# Altium schematic sheet RadToF.SchDoc
size B; SheetNumber: 1; SheetTotal: 4
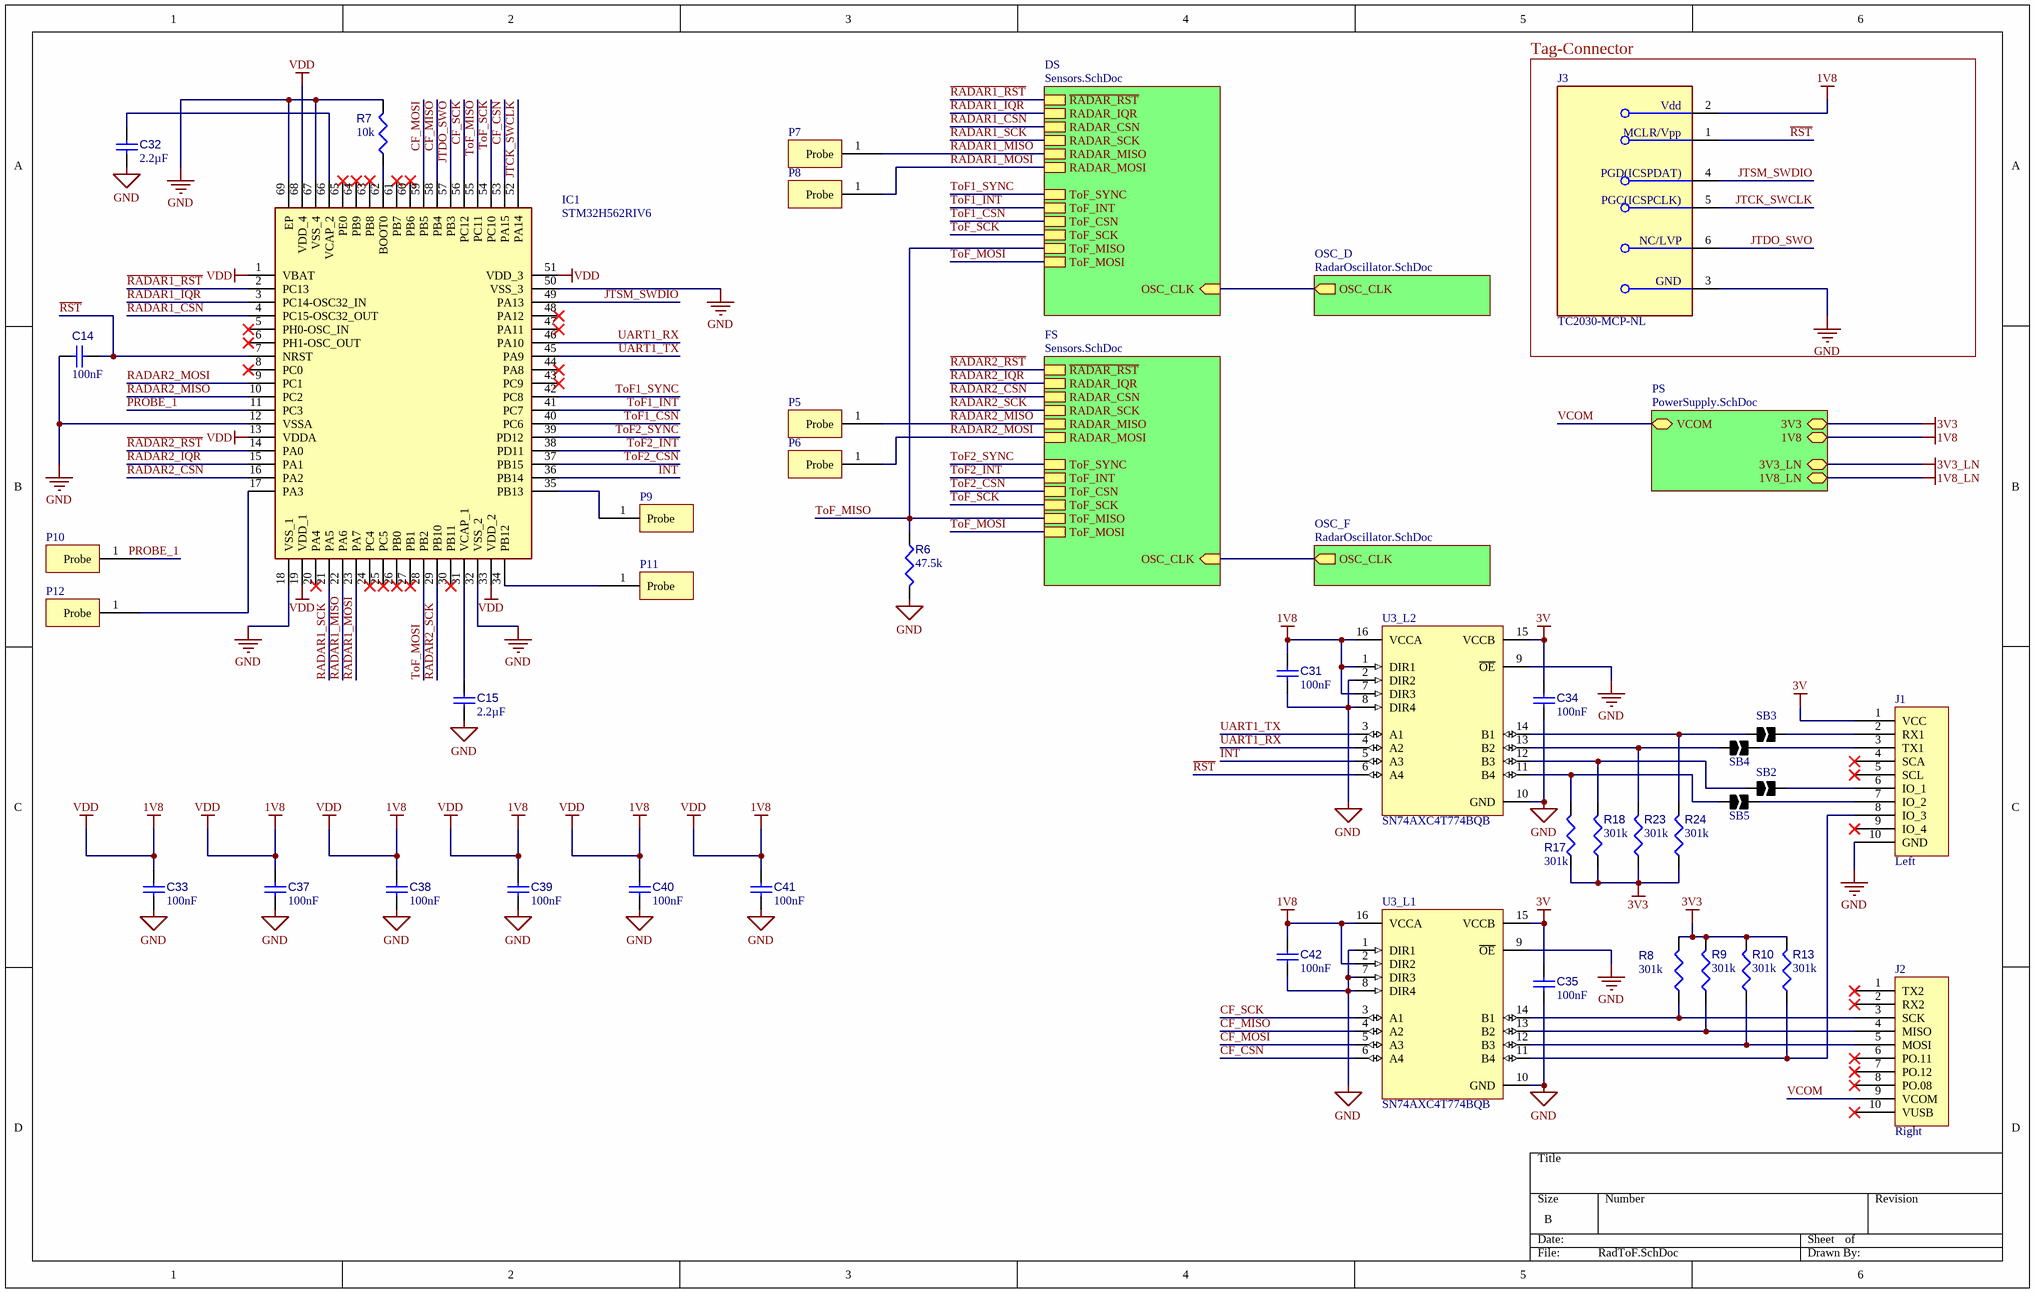
[diagram p0: RadToF.SchDoc]

## Parts
C14  value 100nF  [CAPC0402(1005)60_L]  (hidden comment: Capacitor 100nF +/-20% 50V 0402)
C15  value 2.2µF  [CAPC0402(1005)60_L]  (hidden comment: Capacitor 2,2µF +/-20% 10V 0402)
C31  value 100nF  [CAPC0402(1005)60_L]  (hidden comment: Capacitor 100nF +/-20% 50V 0402)
C32  value 2.2µF  [CAPC0402(1005)60_L]  (hidden comment: Capacitor 2,2µF +/-20% 10V 0402)
C33  value 100nF  [CAPC0402(1005)60_L]  (hidden comment: Capacitor 100nF +/-20% 50V 0402)
C34  value 100nF  [CAPC0402(1005)60_L]  (hidden comment: Capacitor 100nF +/-20% 50V 0402)
C35  value 100nF  [CAPC0402(1005)60_L]  (hidden comment: Capacitor 100nF +/-20% 50V 0402)
C37  value 100nF  [CAPC0402(1005)60_L]  (hidden comment: Capacitor 100nF +/-20% 50V 0402)
C38  value 100nF  [CAPC0402(1005)60_L]  (hidden comment: Capacitor 100nF +/-20% 50V 0402)
C39  value 100nF  [CAPC0402(1005)60_L]  (hidden comment: Capacitor 100nF +/-20% 50V 0402)
C40  value 100nF  [CAPC0402(1005)60_L]  (hidden comment: Capacitor 100nF +/-20% 50V 0402)
C41  value 100nF  [CAPC0402(1005)60_L]  (hidden comment: Capacitor 100nF +/-20% 50V 0402)
C42  value 100nF  [CAPC0402(1005)60_L]  (hidden comment: Capacitor 100nF +/-20% 50V 0402)
IC1  STM32H562RIV6  [STM32H562RIV6]
J1  Left  [CrazyFlieConnector]
J2  Right  [CrazyFlieConnector]
J3  TC2030-MCP-NL  [FP-TC2030-MCP-NL-MFG]
P5  (no value)  [test pad]
P6  (no value)  [test pad]
P7  (no value)  [test pad]
P8  (no value)  [test pad]
P9  (no value)  [test pad]
P10  (no value)  [test pad]
P11  (no value)  [test pad]
P12  (no value)  [test pad]
R6  value 47.5k  [RESC0402(1005)_L]  (hidden comment: Resistor 47K5 +/-1 % 0402 63 mW)
R7  value 10k  [RESC0402(1005)_L]  (hidden comment: Resistor 10K  +/-1 % 0402 63 mW)
R8  value 301k  [RESC0402(1005)_L]  (hidden comment: 301KR2F)
R9  value 301k  [RESC0402(1005)_L]  (hidden comment: 301KR2F)
R10  value 301k  [RESC0402(1005)_L]  (hidden comment: 301KR2F)
R13  value 301k  [RESC0402(1005)_L]  (hidden comment: 301KR2F)
R17  value 301k  [RESC0402(1005)_L]  (hidden comment: 301KR2F)
R18  value 301k  [RESC0402(1005)_L]  (hidden comment: 301KR2F)
R23  value 301k  [RESC0402(1005)_L]  (hidden comment: 301KR2F)
R24  value 301k  [RESC0402(1005)_L]  (hidden comment: 301KR2F)
SB2  SB2_0402  [SB2_0402]  (value not drawn)
SB3  SB2_0402  [SB2_0402]  (value not drawn)
SB4  SB2_0402  [SB2_0402]  (value not drawn)
SB5  SB2_0402  [SB2_0402]  (value not drawn)
U3_L1  SN74AXC4T774BQB  [BQB0016A]
U3_L2  SN74AXC4T774BQB  [BQB0016A]

## Blocks framed on the sheet
Tag-Connector: J3

## Sub-sheets
DS = Sensors.SchDoc: ~{RADAR_RST}, RADAR_IQR, RADAR_CSN, RADAR_SCK, RADAR_MISO, RADAR_MOSI, ToF_SYNC, ToF_INT, ToF_CSN, ToF_SCK, ToF_MISO, ToF_MOSI, OSC_CLK (in)
FS = Sensors.SchDoc: ~{RADAR_RST}, RADAR_IQR, RADAR_CSN, RADAR_SCK, RADAR_MISO, RADAR_MOSI, ToF_SYNC, ToF_INT, ToF_CSN, ToF_SCK, ToF_MOSI, ToF_MISO, OSC_CLK (in)
OSC_D = RadarOscillator.SchDoc: OSC_CLK (out)
OSC_F = RadarOscillator.SchDoc: OSC_CLK (out)
PS = PowerSupply.SchDoc: VCOM (bidir), 3V3 (bidir), 1V8 (bidir), 3V3_LN (bidir), 1V8_LN (bidir)

## Nets
1V8: C31.1 C33.2 C37.2 C38.2 C39.2 C40.2 C41.2 C42.1 IC1.1(VBAT) IC1.13(VDDA) IC1.19(VDD_1) IC1.33(VDD_2) IC1.51(VDD_3) IC1.68(VDD_4) J3.2(Vdd) U3_L1.2(DIR2) U3_L1.16(VCCA) U3_L2.1(DIR1) U3_L2.7(DIR3) U3_L2.16(VCCA) ; sheet PS/1V8  [also labelled VDD]
1V8_LN: sheet PS/1V8_LN
3V: C34.1 C35.1 J1.1(VCC) U3_L1.15(VCCB) U3_L2.15(VCCB)
3V3: R8.2 R9.2 R10.2 R13.2 R17.1 R18.1 R23.1 R24.1 ; sheet PS/3V3
3V3_LN: sheet PS/3V3_LN
GND: C14.2 C15.1 C31.2 C32.1 C33.1 C34.2 C35.2 C37.1 C38.1 C39.1 C40.1 C41.1 C42.2 IC1.12(VSSA) IC1.18(VSS_1) IC1.32(VSS_2) IC1.50(VSS_3) IC1.67(VSS_4) IC1.69(EP) J1.10(GND) J3.3(GND) R6.2 R7.2 U3_L1.1(DIR1) U3_L1.7(DIR3) U3_L1.8(DIR4) U3_L1.9(~{OE}) U3_L1.10(GND) U3_L2.2(DIR2) U3_L2.8(DIR4) U3_L2.9(~{OE}) U3_L2.10(GND)
~{RST}: C14.1 IC1.7(NRST) J3.1(MCLR/Vpp) U3_L2.6(A4)
CF_CSN: IC1.53(PA15) U3_L1.6(A4)
CF_MISO: IC1.58(PB4) U3_L1.4(A2)
CF_MOSI: IC1.59(PB5) U3_L1.5(A3)
CF_SCK: IC1.56(PC12) U3_L1.3(A1)
INT: IC1.36(PB14) U3_L2.5(A3)
JTCK_SWCLK: IC1.52(PA14) J3.5(PGC(ICSPCLK))
JTDO_SWO: IC1.57(PB3) J3.6(NC/LVP)
JTSM_SWDIO: IC1.49(PA13) J3.4(PGD(ICSPDAT))
PROBE_1: IC1.11(PC3) P10.1(Probe)
~{RADAR1_RST}: IC1.2(PC13) ; sheet DS/~{RADAR_RST}
~{RADAR2_RST}: IC1.14(PA0) ; sheet FS/~{RADAR_RST}
RADAR1_CSN: IC1.4(PC15-OSC32_OUT) ; sheet DS/RADAR_CSN
RADAR1_IQR: IC1.3(PC14-OSC32_IN) ; sheet DS/RADAR_IQR
RADAR1_MISO: IC1.22(PA6) P7.1(Probe) ; sheet DS/RADAR_MISO
RADAR1_MOSI: IC1.23(PA7) P8.1(Probe) ; sheet DS/RADAR_MOSI
RADAR1_SCK: IC1.21(PA5) ; sheet DS/RADAR_SCK
RADAR2_CSN: IC1.16(PA2) ; sheet FS/RADAR_CSN
RADAR2_IQR: IC1.15(PA1) ; sheet FS/RADAR_IQR
RADAR2_MISO: IC1.10(PC2) P5.1(Probe) ; sheet FS/RADAR_MISO
RADAR2_MOSI: IC1.9(PC1) P6.1(Probe) ; sheet FS/RADAR_MOSI
RADAR2_SCK: IC1.29(PB10) ; sheet FS/RADAR_SCK
ToF1_CSN: IC1.40(PC6) ; sheet DS/ToF_CSN
ToF1_INT: IC1.41(PC7) ; sheet DS/ToF_INT
ToF1_SYNC: IC1.42(PC8) ; sheet DS/ToF_SYNC
ToF2_CSN: IC1.37(PB15) ; sheet FS/ToF_CSN
ToF2_INT: IC1.38(PD11) ; sheet FS/ToF_INT
ToF2_SYNC: IC1.39(PD12) ; sheet FS/ToF_SYNC
ToF_MISO: IC1.55(PC11) R6.1 ; sheet DS/ToF_MISO, sheet FS/ToF_MISO
ToF_MOSI: IC1.28(PB2) ; sheet DS/ToF_MOSI, sheet FS/ToF_MOSI
ToF_SCK: IC1.54(PC10) ; sheet DS/ToF_SCK, sheet FS/ToF_SCK
UART1_RX: IC1.46(PA10) U3_L2.4(A2)
UART1_TX: IC1.45(PA9) U3_L2.3(A1)
VCOM: J2.9(VCOM) ; sheet PS/VCOM
NetC15_2: C15.2 IC1.31(VCAP_1)
NetC32_2: C32.2 IC1.66(VCAP_2)
NetIC1_17: IC1.17(PA3) P12.1(Probe)
NetIC1_34: IC1.34(PB12) P11.1(Probe)
NetIC1_35: IC1.35(PB13) P9.1(Probe)
NetIC1_62: IC1.62(BOOT0) R7.1
NetJ1_2: J1.2(RX1) SB3.1
NetJ1_3: J1.3(TX1) SB4.1
NetJ1_6: J1.6(IO_1) SB2.1
NetJ1_7: J1.7(IO_2) SB5.1
NetJ1_8: J1.8(IO_3) R13.1 U3_L1.11(B4)
NetJ2_3: J2.3(SCK) R8.1 U3_L1.14(B1)
NetJ2_4: J2.4(MISO) R9.1 U3_L1.13(B2)
NetJ2_5: J2.5(MOSI) R10.1 U3_L1.12(B3)
NetR17_2: R17.2 SB5.2 U3_L2.11(B4)
NetR18_2: R18.2 SB2.2 U3_L2.12(B3)
NetR23_2: R23.2 SB4.2 U3_L2.13(B2)
NetR24_2: R24.2 SB3.2 U3_L2.14(B1)
(unnamed): sheet DS/OSC_CLK, sheet OSC_D/OSC_CLK
(unnamed): sheet FS/OSC_CLK, sheet OSC_F/OSC_CLK

Not connected (* = marked no-connect by the designer): IC1 5(PH0-OSC_IN)* 6(PH1-OSC_OUT)* 8(PC0)* 20(PA4)* 24(PC4)* 25(PC5)* 26(PB0)* 27(PB1)* 30(PB11)* 43(PC9)* 44(PA8)* 47(PA11)* 48(PA12)* 60(PB6)* 61(PB7)* 63(PB8)* 64(PB9)* 65(PE0)*; J1 4(SCA)* 5(SCL)* 9(IO_4)*; J2 1(TX2)* 2(RX2)* 6(PO.11)* 7(PO.12)* 8(PO.08)* 10(VUSB)*

## Library data of the parts
C14 C31 C33-C35 C37-C42 = CMP-001-00067-3: Chip Capacitor, 100nF +/-20%, 50V, 0402, Thickness 0.6 mm; Tolerance: 10%; Min Operating Temperature: -55°C; Pins: 2; Case/Package: 0402; Max Operating Temperature: 85°C; Voltage Rating: 50V; Mounting Technology: SMT
C15 C32 = CMP-001-00056-4: Chip Capacitor, 2,2µF +/-20%, 10V, 0402, Thickness 0.6 mm; Tolerance: 10%; Mounting Technology: SMT; Max Operating Temperature: 85°C; Case/Package: 0402; Pins: 2; Min Operating Temperature: -55°C; Voltage Rating: 10V
IC1 = STM32H562RIV6: ARM Microcontrollers - MCU Arm Cortex-M33 32-bit 250 MHz, up to 2 Mbytes of Flash, 640KB of RAM, I3C, DCMI; Manufacturer_Name: STMicroelectronics; Geometry.Height: 1mm; Manufacturer_Part_Number: STM32H562RIV6; Mouser Part Number: 511-STM32H562RIV6; Mouser Price/Stock: https://www.mouser.co.uk/ProductDetail/STMicroelectronics/STM32H562RIV6?qs=amGC7iS6iy8R%2FTU6LJUskw%3D%3D; Arrow Part Number: *; Arrow Price/Stock: *; Datasheet Link: https://www.st.com/resource/en/datasheet/stm32h562ri.pdf
J1 = CrazyFlieHeader_left: Header to connect to crazy flie pins
J2 = CrazyFlieHeader_right: Header to connect to crazy flie pins
J3 = CMP-205963-000002-1: CABLE TAG-CONNECT IN-CIRCUIT; RoHS Compliant: Yes; Series: -; Reach SVHC Compliant: Yes; Package Quantity: 1; Lead Free: Lead Free
P5-P12 = Test Pad
R6 = CMP-009-00137-3: Chip Resistor, 47,5 kOhms, +/-1 %, 63 mW, -55 to 155 degC, 0402; Power: 63mW; Tolerance: 1%; Pins: 2; Case/Package: 0402; Min Operating Temperature: -55°C; Max Operating Temperature: 155°C
R7 = CMP-009-00149-3: Chip Resistor, 10 kOhms, +/-1 %, 63 mW, -55 to 125 degC, 0402; Power: 63mW; Tolerance: 1%; Min Operating Temperature: -55°C; Case/Package: 0402; Max Operating Temperature: 155°C; Pins: 2
R8-R10 R13 R17 R18 R23 R24 = CMP-009-00092-2: 301K 0.063W 1% 0402 (1005 Metric)  SMD; Power: 63mW; Tolerance: 1%; Mounting Technology: SMT; Case/Package: 0402; Pins: 2
SB2-SB5 = JUMP_SB2_0402: Custom Solder jumper, open
U3_L1 U3_L2 = SHIFT_SN74AXC4T774BQB: 4-Bit Dual-Supply Bus Transceiver with Independent Direction Control, Configurable Voltage Translation, and Tri-State Outputs; Manufacturer: Texas Instruments; Manufacturer Part Number: SN74AXC4T774BQBR; Supplier 1: Mouser; RoHS: No; Category: Buffers, Drivers and Transceivers; Stock 1: 8447; Pricing 1: 1=1.02, 10=0.863, 50=0.863, 100=0.663, 1000=0.463, 10000=0.403 (USD); Supplier Part Number 1: 595-SN74AXC4T774BQBR